# EAGLE design SSTuino_Evo (EAGLE 9.6.2)

## Sheet 1 of 2
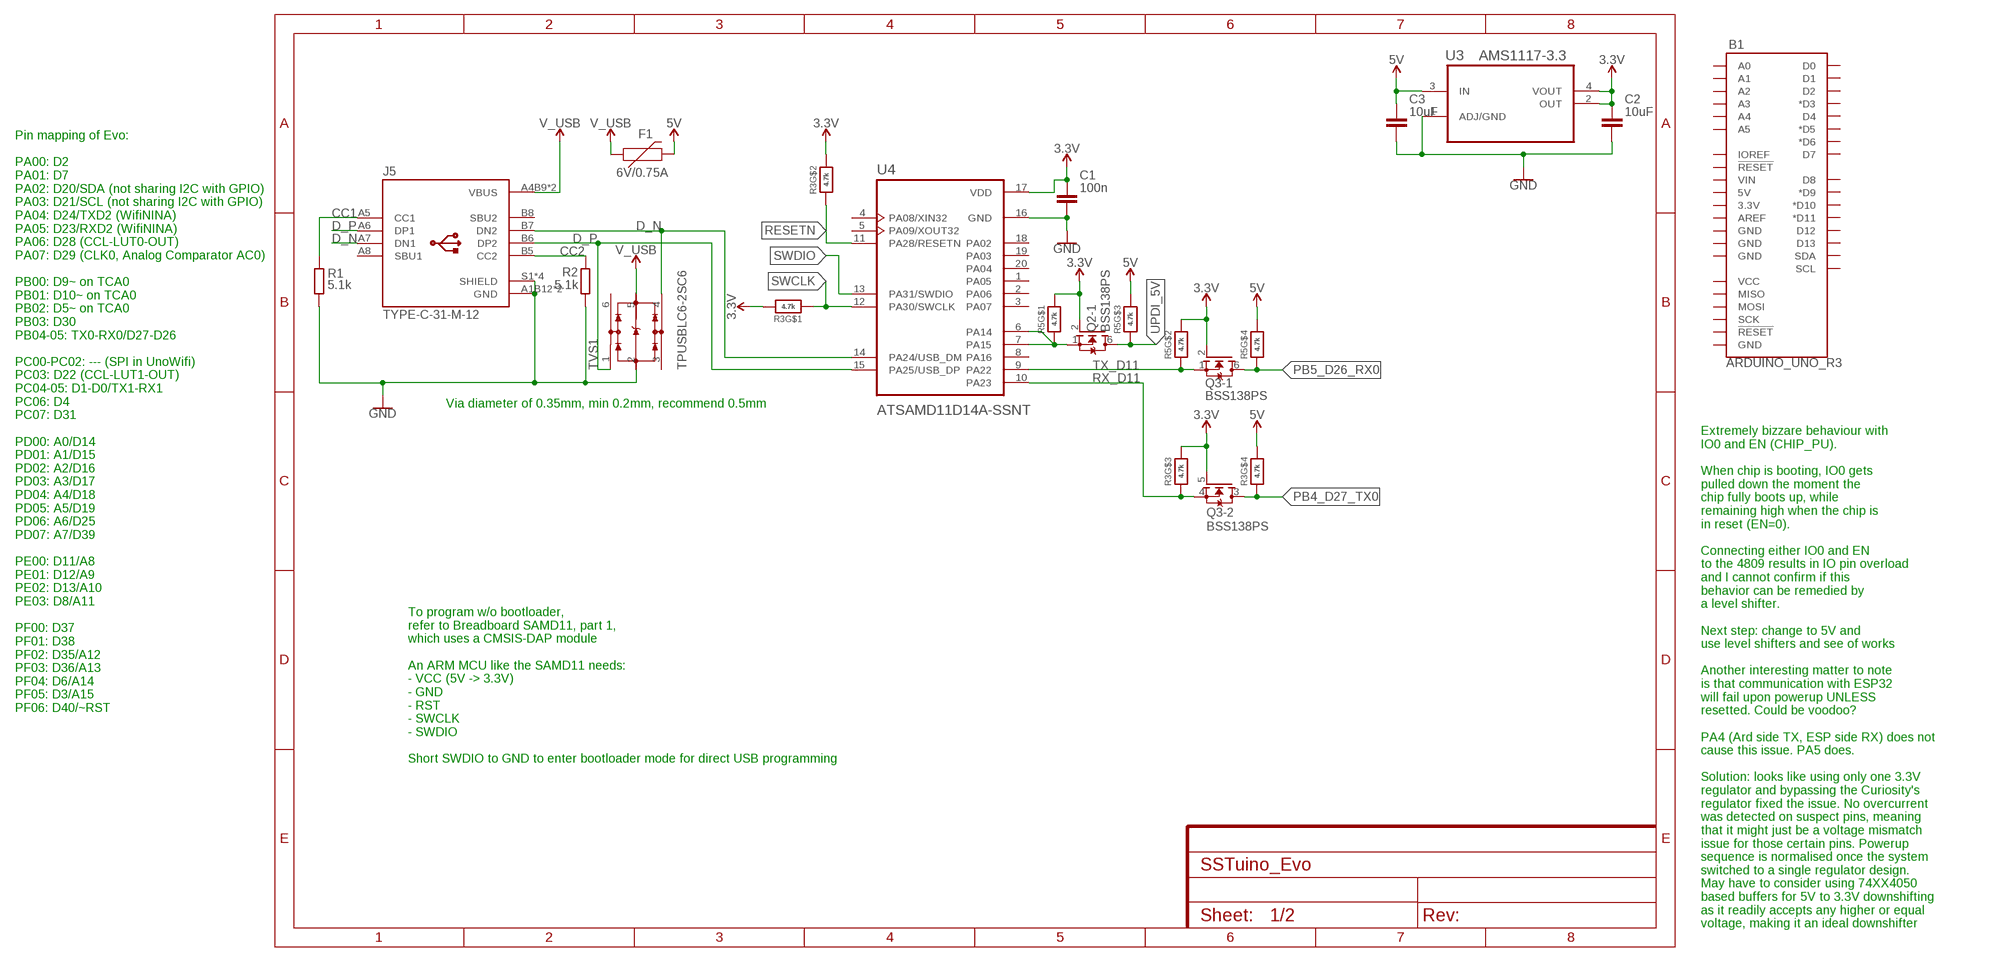
[diagram p0: schematic, sheet 1]

### Parts
B1  ARDUINO_UNO_R3  [ARDUINO_R3]
C1  100n  C_CHIP-0402(1005-METRIC)  [CAPC1005X60]
C2  10uF  C_CHIP-0603(1608-METRIC)  [CAPC1608X85]
C3  10uF  C_CHIP-0603(1608-METRIC)  [CAPC1608X85]
F1  6V/0.75A  PPTC_THREE-QUARTER-AMP  [1206]
J5  TYPE-C-31-M-12  [HRO_TYPE-C-31-M-12]
Q2  BSS138PS  [ARDUINO-TRANSISTORS_SOT363]
Q3  BSS138PS  [ARDUINO-TRANSISTORS_SOT363]
R1  5.1k  R_CHIP-0402(1005-METRIC)  [RESC1005X40]
R2  5.1k  R_CHIP-0402(1005-METRIC)  [RESC1005X40]
R3  4.7k  RESISTOR_4PACK0402  [RESPACK_4X0402]
R5  4.7k  RESISTOR_4PACK0402  [RESPACK_4X0402]
TVS1  TPUSBLC6-2SC6  [SOT95P280X110-6N]
U3  AMS1117-3.3  LM1117MP-3.3  [SOT230P696X180-4N]
U4  ATSAMD11D14A-SSNT  [SOIC127P1030X265-20N]

### Nets
3.3V: C1.1 C2.1 Q2.2(-1:G) Q3.2(-1:G) Q3.5(-2:G) R3.6 R3.7 R3.8 R5.7 R5.8 U3.2(OUT) U3.4(VOUT) U4.17(VDD) ; also sheet 2
5V: C3.1 F1.2 R3.5 R5.5 R5.6 U3.3(IN) ; also sheet 2
CC1: J5.A5(CC1) R1.1
CC2: J5.B5(CC2) R2.2
D_N [differential]: J5.A7(DN1) J5.B7(DN2) TVS1.4(IO3) U4.14(PA24/USB_DM)
D_P [differential]: J5.A6(DP1) J5.B6(DP2) TVS1.1(IO1) U4.15(PA25/USB_DP)
GND: C1.2 C2.2 C3.2 J5.A1B12(GND) J5.B1A12(GND) J5.S1(SHIELD) J5.S2(SHIELD) J5.S3(SHIELD) J5.S4(SHIELD) R1.2 R2.1 TVS1.2(VSS) U3.1(ADJ/GND) U4.16(GND) ; also sheet 2
PB4_D27_TX0: Q3.3(-2:D) R3.4 ; also sheet 2
PB5_D26_RX0: Q3.6(-1:D) R5.4 ; also sheet 2
RESETN: R3.2 U4.11(PA28/RESETN) ; also sheet 2
RX_D11: Q3.4(-2:S) R3.3 U4.10(PA23)
SWCLK: R3.1 U4.12(PA30/SWCLK) ; also sheet 2
SWDIO: U4.13(PA31/SWDIO) ; also sheet 2
TX_D11: Q3.1(-1:S) R5.2 U4.9(PA22)
UPDI_3V3: Q2.1(-1:S) R5.1 U4.6(PA14) U4.7(PA15)
UPDI_5V: Q2.6(-1:D) R5.3 ; also sheet 2
V_USB: F1.1 J5.A4B9(VBUS) J5.B4A9(VBUS) TVS1.5(VCC)
Unconnected: B1.3.3V B1.5V B1.A0 B1.A1 B1.A2 B1.A3 B1.A4 B1.A5 B1.AREF B1.D0 B1.D1 B1.D2 B1.D3(*D3) B1.D4 B1.D5(*D5) B1.D6(*D6) B1.D7 B1.D8 B1.D9(*D9) B1.D10(*D10) B1.D11(*D11) B1.D12 B1.D13 B1.GND@1(GND) B1.GND@2(GND) B1.GND@3(GND) B1.GND@4(GND) B1.IOREF B1.MISO B1.MOSI B1.RESET@1(!RESET!) B1.RESET@2(!RESET!) B1.SCK B1.SCL B1.SDA B1.VCC B1.VIN J5.A8(SBU1) J5.B8(SBU2) TVS1.3(IO2) TVS1.6(IO4) U4.1(PA05) U4.2(PA06) U4.3(PA07) U4.4(PA08/XIN32) U4.5(PA09/XOUT32) U4.8(PA16) U4.18(PA02) U4.19(PA03) U4.20(PA04)

### Notes on the sheet
- Via diameter of 0.35mm, min 0.2mm, recommend 0.5mm
- Pin mapping of Evo:
  
  PA00: D2
  PA01: D7
  PA02: D20/SDA (not sharing I2C with GPIO)
  PA03: D21/SCL (not sharing I2C with GPIO)
  PA04: D24/TXD2 (WifiNINA)
  PA05: D23/RXD2 (WifiNINA)
  PA06: D28 (CCL-LUT0-OUT)
  PA07: D29 (CLK0, Analog Comparator AC0)
  
  PB00: D9~ on TCA0
  PB01: D10~ on TCA0
  PB02: D5~ on TCA0
  PB03: D30
  PB04-05: TX0-RX0/D27-D26
  
  PC00-PC02: --- (SPI in UnoWifi)
  PC03: D22 (CCL-LUT1-OUT)
  PC04-05: D1-D0/TX1-RX1
  PC06: D4
  PC07: D31
  
  PD00: A0/D14
  PD01: A1/D15
  PD02: A2/D16
  PD03: A3/D17
  PD04: A4/D18
  PD05: A5/D19
  PD06: A6/D25
  PD07: A7/D39
  
  PE00: D11/A8
  PE01: D12/A9
  PE02: D13/A10
  PE03: D8/A11
  
  PF00: D37
  PF01: D38
  PF02: D35/A12
  PF03: D36/A13
  PF04: D6/A14
  PF05: D3/A15
  PF06: D40/~RST
- To program w/o bootloader,
  refer to Breadboard SAMD11, part 1,
  which uses a CMSIS-DAP module
  
  An ARM MCU like the SAMD11 needs:
  - VCC (5V -> 3.3V)
  - GND
  - RST
  - SWCLK
  - SWDIO
  
  Short SWDIO to GND to enter bootloader mode for direct USB programming
- Extremely bizzare behaviour with
  IO0 and EN (CHIP_PU). 
  
  When chip is booting, IO0 gets 
  pulled down the moment the 
  chip fully boots up, while 
  remaining high when the chip is
  in reset (EN=0).
  
  Connecting either IO0 and EN
  to the 4809 results in IO pin overload
  and I cannot confirm if this
  behavior can be remedied by
  a level shifter. 
  
  Next step: change to 5V and
  use level shifters and see of works
  
  Another interesting matter to note
  is that communication with ESP32
  will fail upon powerup UNLESS
  resetted. Could be voodoo?
  
  PA4 (Ard side TX, ESP side RX) does not
  cause this issue. PA5 does.
  
  Solution: looks like using only one 3.3V 
  regulator and bypassing the Curiosity's
  regulator fixed the issue. No overcurrent
  was detected on suspect pins, meaning
  that it might just be a voltage mismatch
  issue for those certain pins. Powerup
  sequence is normalised once the system
  switched to a single regulator design.
  May have to consider using 74XX4050
  based buffers for 5V to 3.3V downshifting
  as it readily accepts any higher or equal
  voltage, making it an ideal downshifter

## Sheet 2 of 2
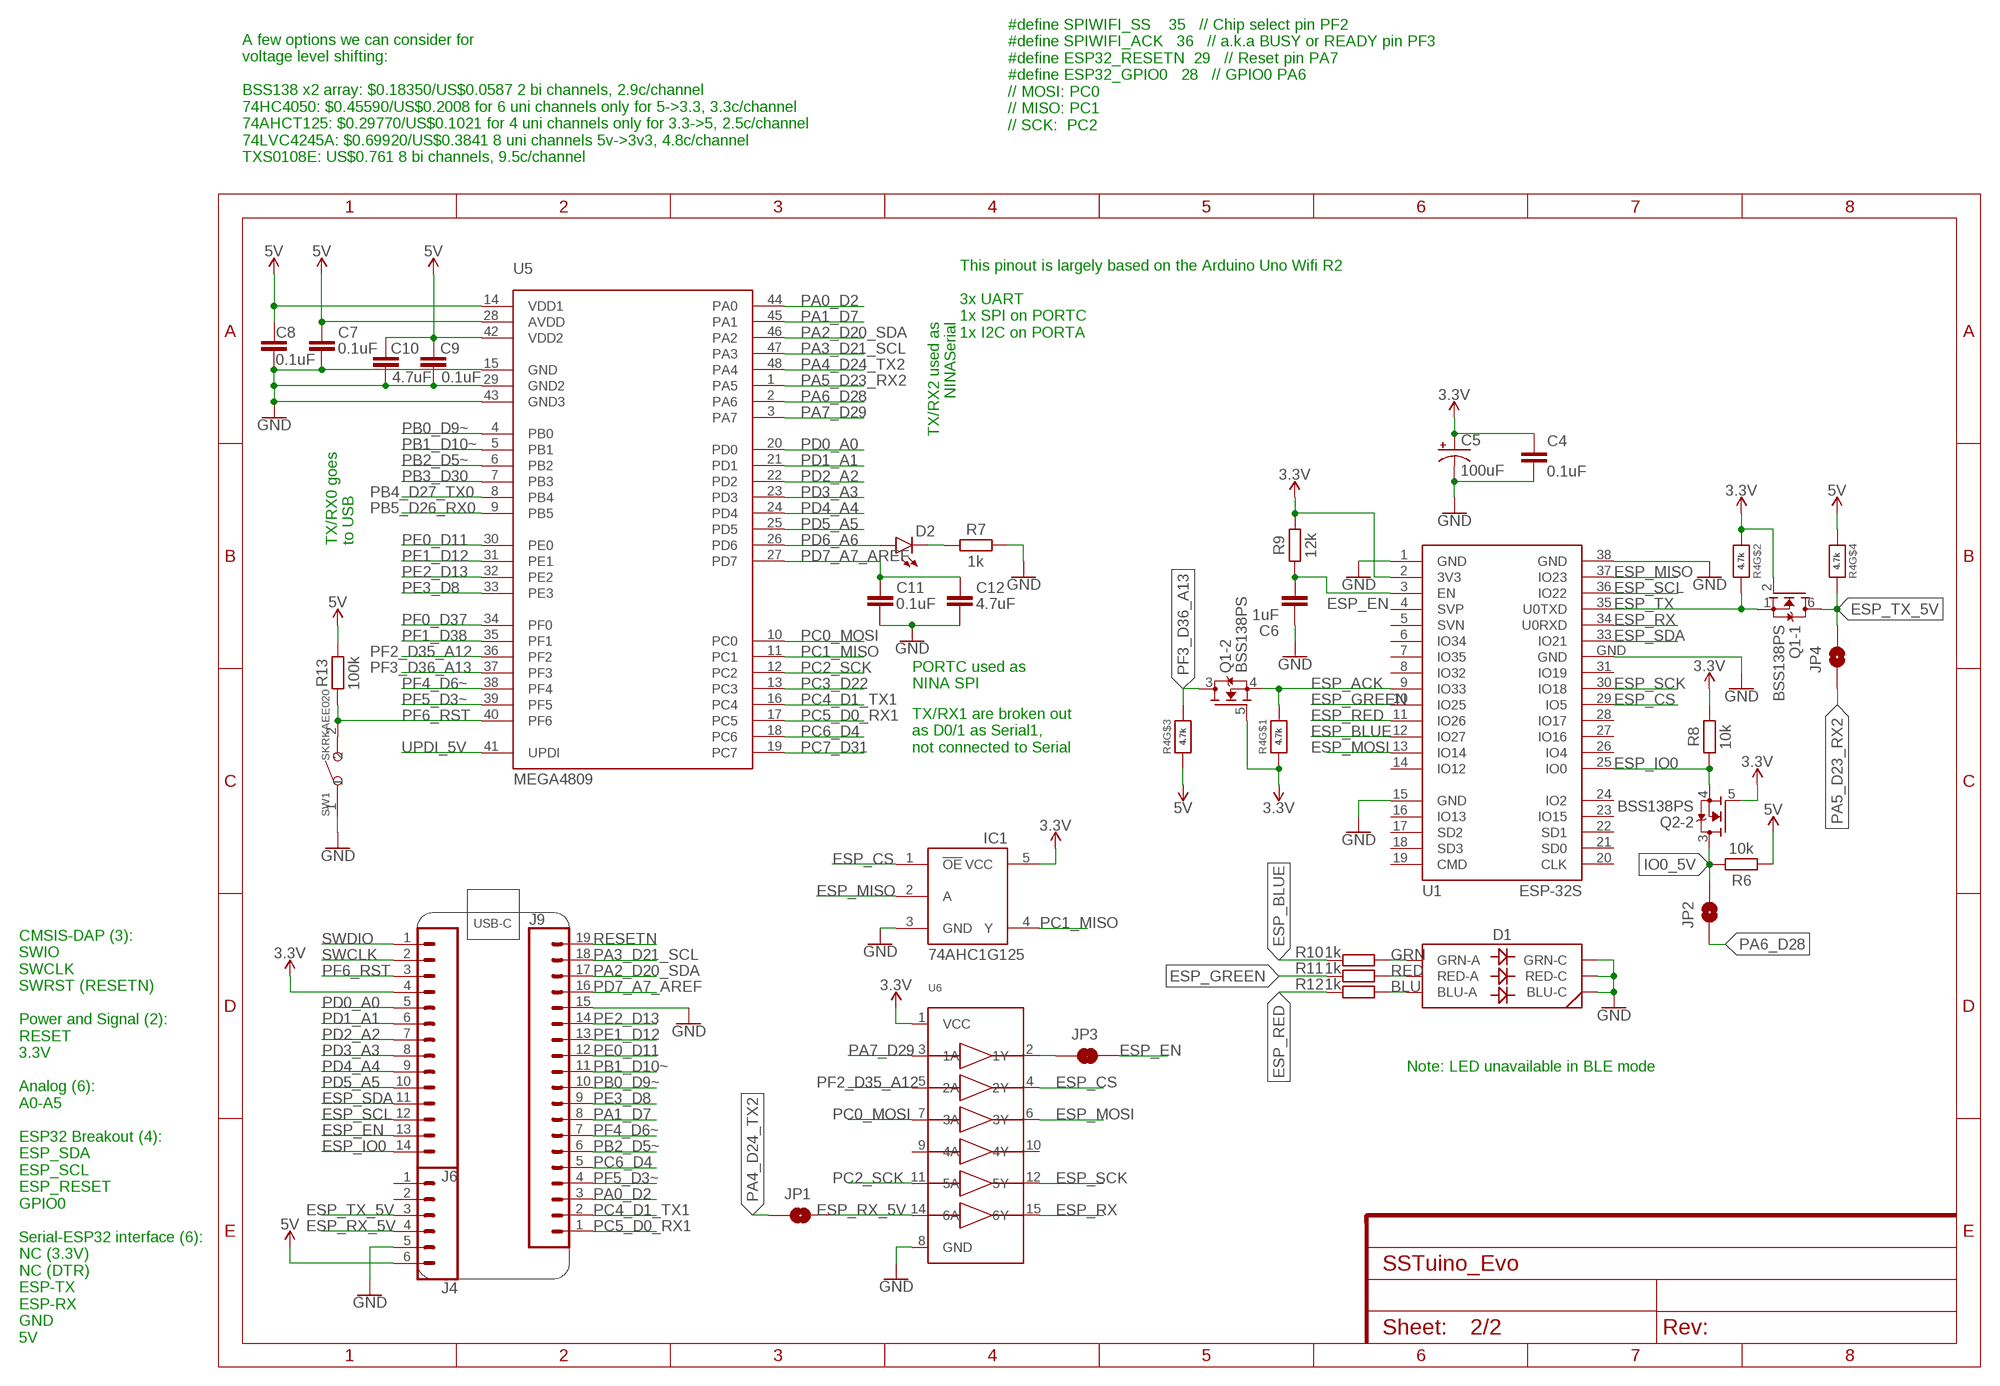
[diagram p1: schematic, sheet 2]

### Parts
C4  0.1uF  C_CHIP-0402(1005-METRIC)  [CAPC1005X60]
C5  100uF  C-POL-US_TANTALUM-1206(3216-METRIC)  [CAPMP3216X180N]
C6  1uF  C_CHIP-0402(1005-METRIC)  [CAPC1005X60]
C7  0.1uF  C_CHIP-0402(1005-METRIC)  [CAPC1005X60]
C8  0.1uF  C_CHIP-0402(1005-METRIC)  [CAPC1005X60]
C9  0.1uF  C_CHIP-0402(1005-METRIC)  [CAPC1005X60]
C10  4.7uF  C_CHIP-0402(1005-METRIC)  [CAPC1005X60]
C11  0.1uF  C_CHIP-0402(1005-METRIC)  [CAPC1005X60]
C12  4.7uF  C_CHIP-0402(1005-METRIC)  [CAPC1005X60]
D1  LED-RGBTC5050RGBF08  [LED-TRICOLOR-5050]
D2  LED0603  [LED-0603]
IC1  74AHC1G125  [SOT23-5L]
J4  CONN_06NO_SILK_FEMALE_PTH  [1X06_NO_SILK]
J6  CONN_14NO_SILK  [1X14_NO_SILK]
J9  CONN_191X19_NO_SILK  [1X19_NO_SILK]
JP1  JUMPER-SMT_2_NO_SILK  [SMT-JUMPER_2_NO_SILK]
JP2  JUMPER-SMT_2_NO_SILK  [SMT-JUMPER_2_NO_SILK]
JP3  JUMPER-SMT_2_NC_TRACE_SILK  [SMT-JUMPER_2_NC_TRACE_SILK]
JP4  JUMPER-SMT_2_NO_SILK  [SMT-JUMPER_2_NO_SILK]
Q1  BSS138PS  [ARDUINO-TRANSISTORS_SOT363]
R4  4.7k  RESISTOR_4PACK0402  [RESPACK_4X0402]
R6  10k  R_CHIP-0402(1005-METRIC)  [RESC1005X40]
R7  1k  R_CHIP-0402(1005-METRIC)  [RESC1005X40]
R8  10k  R_CHIP-0402(1005-METRIC)  [RESC1005X40]
R9  12k  R_CHIP-0402(1005-METRIC)  [RESC1005X40]
R10  1k  R_CHIP-0402(1005-METRIC)  [RESC1005X40]
R11  1k  R_CHIP-0402(1005-METRIC)  [RESC1005X40]
R12  1k  R_CHIP-0402(1005-METRIC)  [RESC1005X40]
R13  100k  R_CHIP-0402(1005-METRIC)  [RESC1005X40]
SW1  SKRKAEE020  SMD-BUTTON(2P-3.9X2.9X1.5+0.4MM)-SKRKAEE020  [SW2-2.6-3.9X2.9X1.5+0.4MM]
U1  ESP-32S  [ESP-32S]
U5  MEGA4809  [TQFP48]
U6  74HC4050DTSSOP  [TSSOP16]

### Nets
3.3V: C4.1 C5.1(+) IC1.5(VCC) J6.4 Q1.2(-1:G) Q1.5(-2:G) Q2.5(-2:G) R4.1 R4.2 R8.2 R9.2 U1.2(3V3) U6.1(VCC) ; also sheet 1
5V: C7.1 C8.1 C9.1 C10.1 J4.6 R4.3 R4.4 R6.1 R13.2 U5.14(VDD1) U5.28(AVDD) U5.42(VDD2) ; also sheet 1
BLU: D1.6(BLU-A) R12.2
ESP_ACK: Q1.4(-2:S) R4.8 U1.9(IO33)
ESP_BLUE: R10.1 U1.12(IO27)
ESP_CS: IC1.1(!OE) U1.29(IO5) U6.4(2Y)
ESP_EN: C6.2 J6.13 JP3.2 R9.1 U1.3(EN)
ESP_GREEN: R11.1 U1.10(IO25)
ESP_IO0: J6.14 Q2.4(-2:S) R8.1 U1.25(IO0)
ESP_MISO: IC1.2(A) U1.37(IO23)
ESP_MOSI: U1.13(IO14) U6.6(3Y)
ESP_RED: R12.1 U1.11(IO26)
ESP_RX: U1.34(U0RXD) U6.15(6Y)
ESP_RX_5V: J4.4 JP1.2 U6.14(6A)
ESP_SCK: U1.30(IO18) U6.12(5Y)
ESP_SCL: J6.12 U1.36(IO22)
ESP_SDA: J6.11 U1.33(IO21)
ESP_TX: Q1.1(-1:S) R4.7 U1.35(U0TXD)
ESP_TX_5V: J4.3 JP4.2 Q1.6(-1:D) R4.5
GND: C4.2 C5.2(-) C6.1 C7.2 C8.2 C9.2 C10.2 C11.2 C12.2 D1.1(BLU-C) D1.2(RED-C) D1.3(GRN-C) IC1.3(GND) J4.5 J9.15 R7.2 SW1.1 U1.1(GND) U1.15(GND) U1.38(GND) U1.GND U5.15(GND) U5.29(GND2) U5.43(GND3) U6.8(GND) ; also sheet 1
GRN: D1.4(GRN-A) R10.2
IO0_5V: JP2.2 Q2.3(-2:D) R6.2
N$2: D2.C R7.1
N$4: JP3.1 U6.2(1Y)
PA0_D2: J9.3 U5.44(PA0)
PA1_D7: J9.8 U5.45(PA1)
PA2_D20_SDA: J9.17 U5.46(PA2)
PA3_D21_SCL: J9.18 U5.47(PA3)
PA4_D24_TX2: JP1.1 U5.48(PA4)
PA5_D23_RX2: JP4.1 U5.1(PA5)
PA6_D28: JP2.1 U5.2(PA6)
PA7_D29: U5.3(PA7) U6.3(1A)
PB0_D9~: J9.10 U5.4(PB0)
PB1_D10~: J9.11 U5.5(PB1)
PB2_D5~: J9.6 U5.6(PB2)
PB3_D30: U5.7(PB3)
PB4_D27_TX0: U5.8(PB4) ; also sheet 1
PB5_D26_RX0: U5.9(PB5) ; also sheet 1
PC0_MOSI: U5.10(PC0) U6.7(3A)
PC1_MISO: IC1.4(Y) U5.11(PC1)
PC2_SCK: U5.12(PC2) U6.11(5A)
PC3_D22: U5.13(PC3)
PC4_D1_TX1: J9.2 U5.16(PC4)
PC5_D0_RX1: J9.1 U5.17(PC5)
PC6_D4: J9.5 U5.18(PC6)
PC7_D31: U5.19(PC7)
PD0_A0: J6.5 U5.20(PD0)
PD1_A1: J6.6 U5.21(PD1)
PD2_A2: J6.7 U5.22(PD2)
PD3_A3: J6.8 U5.23(PD3)
PD4_A4: J6.9 U5.24(PD4)
PD5_A5: J6.10 U5.25(PD5)
PD6_A6: D2.A U5.26(PD6)
PD7_A7_AREF: C11.1 C12.1 J9.16 U5.27(PD7)
PE0_D11: J9.12 U5.30(PE0)
PE1_D12: J9.13 U5.31(PE1)
PE2_D13: J9.14 U5.32(PE2)
PE3_D8: J9.9 U5.33(PE3)
PF0_D37: U5.34(PF0)
PF1_D38: U5.35(PF1)
PF2_D35_A12: U5.36(PF2) U6.5(2A)
PF3_D36_A13: Q1.3(-2:D) R4.6 U5.37(PF3)
PF4_D6~: J9.7 U5.38(PF4)
PF5_D3~: J9.4 U5.39(PF5)
PF6_RST: J6.3 R13.1 SW1.2 U5.40(PF6)
RED: D1.5(RED-A) R11.2
RESETN: J9.19 ; also sheet 1
SWCLK: J6.2 ; also sheet 1
SWDIO: J6.1 ; also sheet 1
UPDI_5V: U5.41(UPDI) ; also sheet 1
Unconnected: J4.1 J4.2 U1.4(SVP) U1.5(SVN) U1.6(IO34) U1.7(IO35) U1.8(IO32) U1.14(IO12) U1.16(IO13) U1.17(SD2) U1.18(SD3) U1.19(CMD) U1.20(CLK) U1.21(SD0) U1.22(SD1) U1.23(IO15) U1.24(IO2) U1.26(IO4) U1.27(IO16) U1.28(IO17) U1.31(IO19) U6.9(4A) U6.10(4Y)

### Notes on the sheet
- #define SPIWIFI_SS    35   // Chip select pin PF2
  #define SPIWIFI_ACK   36   // a.k.a BUSY or READY pin PF3
  #define ESP32_RESETN  29   // Reset pin PA7
  #define ESP32_GPIO0   28   // GPIO0 PA6
  // MOSI: PC0
  // MISO: PC1
  // SCK:  PC2
- A few options we can consider for
  voltage level shifting:
  
  BSS138 x2 array: $0.18350/US$0.0587 2 bi channels, 2.9c/channel
  74HC4050: $0.45590/US$0.2008 for 6 uni channels only for 5->3.3, 3.3c/channel
  74AHCT125: $0.29770/US$0.1021 for 4 uni channels only for 3.3->5, 2.5c/channel
  74LVC4245A: $0.69920/US$0.3841 8 uni channels 5v->3v3, 4.8c/channel
  TXS0108E: US$0.761 8 bi channels, 9.5c/channel
- TX/RX2 used as
  NINASerial
- This pinout is largely based on the Arduino Uno Wifi R2
  
  3x UART
  1x SPI on PORTC
  1x I2C on PORTA
- TX/RX0 goes
  to USB
- PORTC used as
  NINA SPI
- TX/RX1 are broken out 
  as D0/1 as Serial1,
  not connected to Serial
- USB-C
- Note: LED unavailable in BLE mode
- CMSIS-DAP (3):
  SWIO
  SWCLK
  SWRST (RESETN)
  
  Power and Signal (2):
  RESET
  3.3V
  
  Analog (6):
  A0-A5
  
  ESP32 Breakout (4):
  ESP_SDA
  ESP_SCL
  ESP_RESET
  GPIO0
  
  Serial-ESP32 interface (6):
  NC (3.3V)
  NC (DTR)
  ESP-TX
  ESP-RX
  GND
  5V

## Library data of the parts
B1 = SparkFun-Boards:ARDUINO_UNO_R3: Arduino R3 Footprint with SPI header Arduino Uno R3 Compatible Footprint. Matches PCB size of the original board. SparkFun Products: SAMD21 Dev Breakout <https://www.sparkfun.com/products/13672> RedBoard <https://www.sparkfun.com/products/12757> R3 Stackable Headers <https://www.sparkfun.com/products/11417>
C1-C4 C6-C12 = Capacitor:C: Capacitor - Generic; CATEGORY: Capacitor
C5 = Capacitor:C-POL-US: Capacitor Polarised - ANSI; CATEGORY: Capacitor
D1 = D3ltav's Custom:LED-RGB: LED-RGB 6 pin RGB LED (no common connector) Warning: please check and double check your pinout vs. the datasheet! 5050 SMD LEDs are commonly packaged in all sorts of weird, non-standard pinouts. This footprint and symbol is only applicable to the LED mentioned below Packages: LED-TRICOLOR-5050 - Based on TC5050RGBF08 RGB LED <https://datasheet.lcsc.com/szlcsc/2009231707_TCWIN-TC5050RGBF08-3CJH-AF53A_C784540.pdf>; PROD_ID: DIO-10298
D2 = SparkFun-LED:LED: LED (Generic) Standard schematic elements and footprints for 5mm, 3mm, 1206, and 0603 sized LEDs. Generic LEDs with no color specified.
F1 = SparkFun-Fuses:PPTC: Resettable Fuse PPTC Resettable Fuse. Really a sort of resistor with a polymeric positive temperature coefficient whose resistance increases dramatically with an increase in temperature. When heated by the power passing through the resistance rises causing the current to be limited, protecting the circuit. This is achieved by the transition of the polymer from a crystalline to an amorphous state where the conductive carbon separates breaking the conductive pathways found in the cool crystalline structure. When a PPTC cools back down it resumes conducting letting the circuit turn back on. SparkFun Products: SparkFun RedBoard - Programmed with Arduino <https://www.sparkfun.com/products/12757> Pro Micro - 5V/16MHz <https://www.sparkfun.com/products/12640> Arduino Pro 328 - 5V/16MHz <https://www.sparkfun.com/products/10915> MP3 Trigger <https://www.sparkfun.com/products/13720>; LCSC_PART: C99563; PROD_ID: RES-11150
IC1 = adafruit:74AHC1G125; LCSC_PART: C124295
J4 = SparkFun-Connectors:CONN_06: Multi connection point. Often used as Generic Header-pin footprint for 0.1 inch spaced/style header connections On any of the 0.1 inch spaced packages, you can populate with these: Break Away Headers - Straight <https://www.sparkfun.com/products/116> (PRT-00116) Break Away Male Headers - Right Angle <https://www.sparkfun.com/products/553> (PRT-00553) Female Headers <https://www.sparkfun.com/products/115> (PRT-00115) Break Away Headers - Machine Pin <https://www.sparkfun.com/products/117> (PRT-00117) Break Away Female Headers - Swiss Machine Pin <https://www.sparkfun.com/products/743> (PRT-00743) Arduino Stackable Header - 6 Pin <https://www.sparkfun.com/products/9280> (PRT-09280) For SCREWTERMINALS and SPRING TERMINALS visit here: Screw Terimnals on SparkFun.com <https://www.sparkfun.com/search/results?term=Screw+Terminals> (5mm/3.5mm/2.54mm spacing) This device is also useful as a general connection point to wire up your design to another part of your project. Our various solder wires solder well into these plated through hole pads. Hook-Up Wire - Assortment (Stranded, 22 AWG) <https://www.sparkfun.com/products/11375> (PRT-11375) Hook-Up Wire - Assortment (Solid Core, 22 AWG) <https://www.sparkfun.com/products/11367> (PRT-11367) View the entire wire category on our website here <https://www.sparkfun.com/categories/141>; PROD_ID: CONN-08437
J5 = D3ltav's Custom:TYPE-C-31-M-12: USB Connectors 24 Receptacle 1 8.94*7.3mm RoHS Check prices <https://pricing.snapeda.com/parts/TYPE-C-31-M-12/HRO%20Electronics%20Co.%2C%20Ltd./view-part?ref=eda>; AVAILABILITY: No availability data; DESCRIPTION: USB Connectors 24 Receptacle 1 8.94*7.3mm RoHS; LCSC_PART: C165948; MF: HRO Electronics Co., Ltd.; MP: TYPE-C-31-M-12; PACKAGE: Package; PRICE: None
J6 = SparkFun-Connectors:CONN_14: Multi connection point. Often used as Generic Header-pin footprint for 0.1 inch spaced/style header connections On any of the 0.1 inch spaced packages, you can populate with these: Break Away Headers - Straight <https://www.sparkfun.com/products/116> (PRT-00116) Break Away Male Headers - Right Angle <https://www.sparkfun.com/products/553> (PRT-00553) Female Headers <https://www.sparkfun.com/products/115> (PRT-00115) Break Away Headers - Machine Pin <https://www.sparkfun.com/products/117> (PRT-00117) Break Away Female Headers - Swiss Machine Pin <https://www.sparkfun.com/products/743> (PRT-00743) For SCREWTERMINALS and SPRING TERMINALS visit here: Screw Terimnals on SparkFun.com <https://www.sparkfun.com/search/results?term=Screw+Terminals> (5mm/3.5mm/2.54mm spacing) This device is also useful as a general connection point to wire up your design to another part of your project. Our various solder wires solder well into these plated through hole pads. Hook-Up Wire - Assortment (Stranded, 22 AWG) <https://www.sparkfun.com/products/11375> (PRT-11375) Hook-Up Wire - Assortment (Solid Core, 22 AWG) <https://www.sparkfun.com/products/11367> (PRT-11367) View the entire wire category on our website here <https://www.sparkfun.com/categories/141> Special notes: Molex polarized connector foot print use with SKU : PRT-08231 with associated crimp pins and housings. 1MM SMD Version SKU: PRT-10208 NOTES ON THE VARIANTS LOCK and LOCK_LONGPADS... This footprint was designed to help hold the alignment of a through-hole component (i.e. 6-pin header) while soldering it into place. You may notice that each hole has been shifted either up or down by 0.005 of an inch from it's more standard position (which is a perfectly straight line). This slight alteration caused the pins (the squares in the middle) to touch the edges of the holes. Because they are alternating, it causes a "brace" to hold the component in place. 0.005 has proven to be the perfect amount of "off-center" position when using our standard breakaway headers. Although looks a little odd when you look at the bare footprint, once you have a header in there, the alteration is very hard to notice. Also,if you push a header all the way into place, it is covered up entirely on the bottom side.
J9 = SparkFun-Connectors:CONN_19: Multi connection point. Often used as Generic Header-pin footprint for 0.1 inch spaced/style header connections On any of the 0.1 inch spaced packages, you can populate with these: Break Away Headers - Straight <https://www.sparkfun.com/products/116> (PRT-00116) Break Away Male Headers - Right Angle <https://www.sparkfun.com/products/553> (PRT-00553) Female Headers <https://www.sparkfun.com/products/115> (PRT-00115) Break Away Headers - Machine Pin <https://www.sparkfun.com/products/117> (PRT-00117) Break Away Female Headers - Swiss Machine Pin <https://www.sparkfun.com/products/743> (PRT-00743) For SCREWTERMINALS and SPRING TERMINALS visit here: Screw Terimnals on SparkFun.com <https://www.sparkfun.com/search/results?term=Screw+Terminals> (5mm/3.5mm/2.54mm spacing) This device is also useful as a general connection point to wire up your design to another part of your project. Our various solder wires solder well into these plated through hole pads. Hook-Up Wire - Assortment (Stranded, 22 AWG) <https://www.sparkfun.com/products/11375> (PRT-11375) Hook-Up Wire - Assortment (Solid Core, 22 AWG) <https://www.sparkfun.com/products/11367> (PRT-11367) View the entire wire category on our website here <https://www.sparkfun.com/categories/141> Special notes: Molex polarized connector foot print use with SKU : PRT-08231 with associated crimp pins and housings. 1MM SMD Version SKU: PRT-10208 NOTES ON THE VARIANTS LOCK and LOCK_LONGPADS... This footprint was designed to help hold the alignment of a through-hole component (i.e. 6-pin header) while soldering it into place. You may notice that each hole has been shifted either up or down by 0.005 of an inch from it's more standard position (which is a perfectly straight line). This slight alteration caused the pins (the squares in the middle) to touch the edges of the holes. Because they are alternating, it causes a "brace" to hold the component in place. 0.005 has proven to be the perfect amount of "off-center" position when using our standard breakaway headers. Although looks a little odd when you look at the bare footprint, once you have a header in there, the alteration is very hard to notice. Also,if you push a header all the way into place, it is covered up entirely on the bottom side.
JP1 JP2 JP4 = SparkFun-Jumpers:JUMPER-SMT_2_NO: Normally open jumper This jumper has two pads in close proximity to each other. Apply solder to close the connection. Round pads are easier to solder for beginners, but are a lot larger. SparkFun Product that uses the round pads: SparkFun EL Sequencer <https://www.sparkfun.com/products/12781>
JP3 = SparkFun-Jumpers:JUMPER-SMT_2_NC_TRACE: Normally closed trace jumper This jumper has a trace between two pads so it's normally closed (NC). Use a razor knife to open the connection. For best results follow the IPC guidelines for cutting traces: Cutout at least 0.063 mm (0.005 in). Remove all loose material to clean up the cut area. Seal the cut with an approved epoxy. Reapply solder to reclose the connection.
Q1-Q3 = D3ltav's Custom:BSS138PS: MOSFET 2N-CH 60V 0.32A 6TSSOP; CODE-ARDUINO: 2323; DATASHEET: https://assets.nexperia.com/documents/data-sheet/BSS138PS.pdf; DISTRIBUTOR-LINK: http://www.digikey.com/product-detail/en/nxp-semiconductors/BSS138PS,115/568-8393-1-ND/2763927; DISTRIBUTOR-PN: 568-8393-1-ND; LCSC_PART: C193381; MANUFACTURER: NXP; MANUFACTURER-PN: BSS138PS,115
R1 R2 R6-R13 = Resistor:R: Resistor Fixed - Generic; CATEGORY: Resistor; SUB-CATEGORY: Fixed
R3-R5 = D3ltav's Custom:RESISTOR_4PACK: Resistor Packs (4 resistors) 4 x 0603 10K 1/16W - Digikey: YC164J-10KCT-ND; LCSC_PART: C1980
SW1 = D3ltav's Custom:SMD-BUTTON(2P-3.9X2.9X1.5+0.4MM): 311020047; LCSC_PART: C115357; MPN: SKRKAEE020
TVS1 = D3ltav's Custom:TPUSBLC6-2SC6: TPUSBLC6-2SC6 Low Capacitance 2-Line ESD Protection www.sot23.com.tw; LCSC_PART: C558442
U1 = esp32:ESP-32S: Ai-Thinker ESP-32S
U3 = D3ltav's Custom:LM1117MP-3.3: Linear regulators; LCSC_PART: C6186; MPN: LM1117MP-3.3; OC_FARNELL: 9778195; OC_NEWARK: 41K3470; PACKAGE: SOT223-3; SUPPLIER: NationalSemiconductor
U4 = D3ltav's Custom:ATSAMD11D14A-SSNT; AVAILABILITY: In Stock; DESCRIPTION: ARM® Cortex®-M0+ SAM D11D Microcontroller IC 32-Bit 48MHz 16KB (16K x 8) FLASH 20-SOIC; LCSC_PART: C2053599; MF: Microchip; MP: ATSAMD11D14A-SSNT; PACKAGE: SOIC-20 Microchip; PRICE: None
U5 = microwavemont_ATMEGA4809:MEGA4809; LCSC_PART: C189475
U6 = D3ltav's Custom:74HC4050D: 6-channel level shifter 74HC4050D - 2V-6V Supply SOIC16 Digikey: 74HC4050D,653-ND Mouser: 771-74HC4050D-T TSSOP16 Digikey: 296-9215-1-ND Mouser:; LCSC_PART: C43181

## Net classes
0 default: width 0.254 mm, drill 0.35 mm
1 differential: width 0.254 mm

## Board
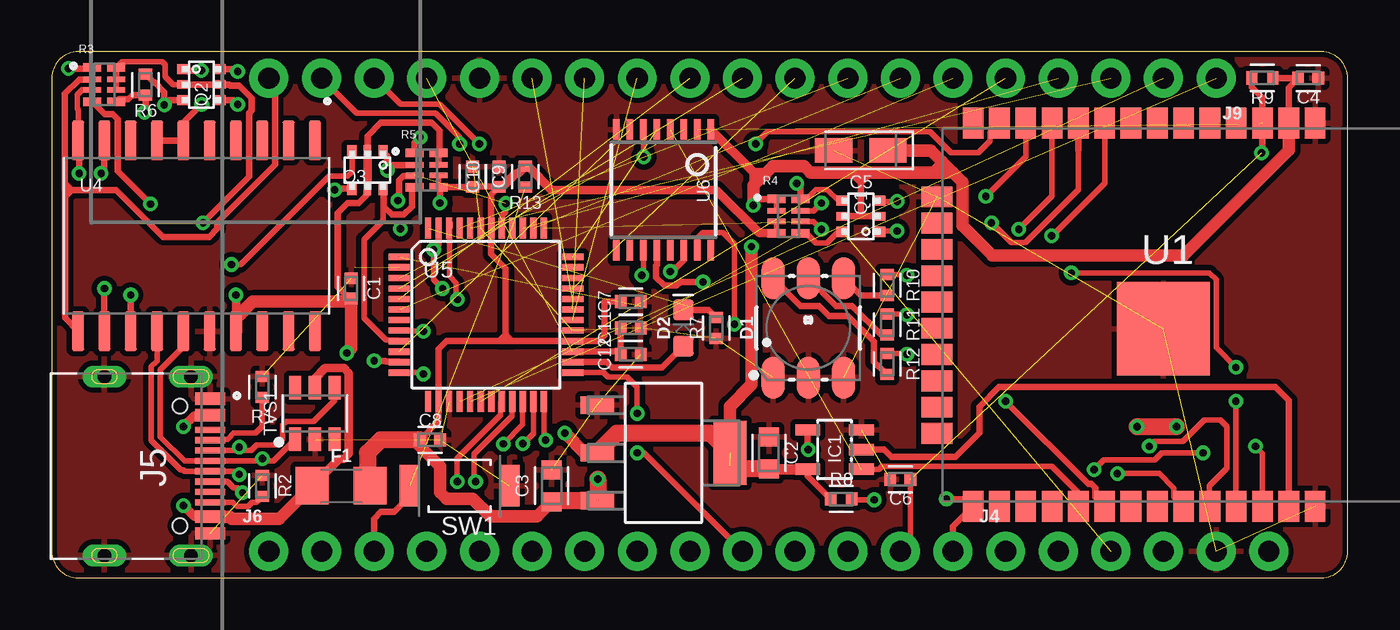
[diagram p2: board, top side]
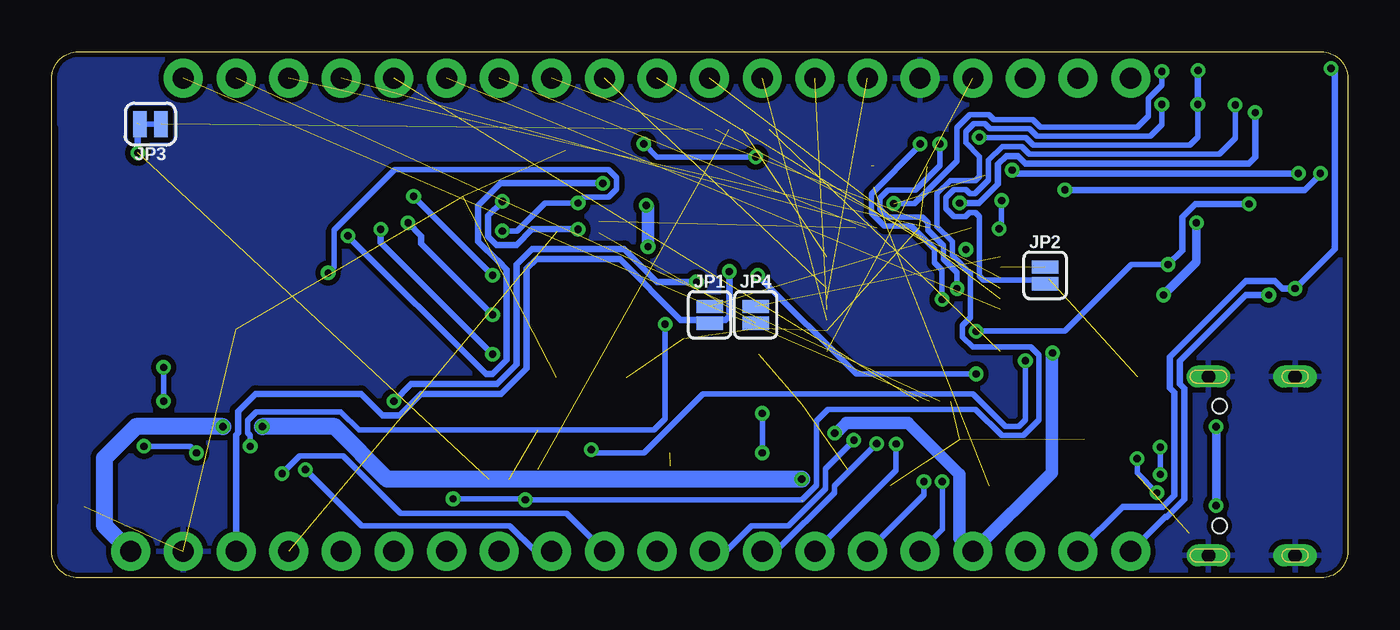
[diagram p3: board, bottom side, seen from below]

Size 62.55 x 25.4 mm. Coordinates in mm from the lower left corner, seen from the top.
Outline: 0,24.13 0,1.27 arc90 1.27,0 61.28,0 arc90 62.55,1.27 62.55,24.13 arc90 61.28,25.4 1.27,25.4 arc90 0,24.13
Copper layers (1*16): Top 0.035mm / dielectric 1.5mm / Bottom 0.035mm
Design rules "SparkFun-2-Layer-General-JLCPCB": minimum track width 7mil, minimum drill 0.3mm, track to track 7mil, track to pad 7mil, pad to pad 7mil, via to via 7mil, smd to smd 7mil, copper to edge 7mil, drill to drill 7mil, minimum pad ring 7mil, minimum via ring 7mil, stop-mask expansion 3mil, vias tented up to drill 25mil, thermal gap 10mil

### Footprints (pad centres in the part's own frame; a part is rotated, then mirrored left to right if it is on the bottom)
ARDUINO_R3 = drill 1.016 pad 1.93: 3.3V 2.54,-24.13; 5V 5.08,-24.13; A0 17.78,-24.13; A1 20.32,-24.13; A2 22.86,-24.13; A3 25.4,-24.13; A4 27.94,-24.13; A5 30.48,-24.13; AREF -9.144,24.13; D0 30.48,24.13; D1 27.94,24.13; D2 25.4,24.13; D3 22.86,24.13; D4 20.32,24.13; D5 17.78,24.13; D6 15.24,24.13; D7 12.7,24.13; D8 8.636,24.13; D9 6.096,24.13; D10 3.556,24.13; D11 1.016,24.13; D12 -1.524,24.13; D13 -4.064,24.13; GND@1 7.62,-24.13; GND@2 10.16,-24.13; GND@3 -6.604,24.13; GND@4 33.16,-1.32; IOREF -2.54,-24.13; MISO 30.62,3.76; MOSI 33.16,1.22; NC -5.08,-24.13; RESET@1 0,-24.13; RESET@2 30.62,-1.32; SCK 30.62,1.22; SCL -14.224,24.13; SDA -11.684,24.13; VCC 33.16,3.76; VIN 12.7,-24.13 | hole 3.175: -17.78,24.13; 33.02,8.89; 33.02,-19.05; -19.05,-24.13
CAPC1005X60 = smd 0.56 x 0.629: 1 -0.485,0; 2 0.485,0
CAPC1608X85 = smd 0.921 x 0.97: 1 -0.775,0; 2 0.775,0
CAPMP3216X180N = smd 1.796 x 1.189: 1 -1.31,0; 2 1.31,0
LED-TRICOLOR-5050 = smd 2 x 1.1: 1 2.4,-1.7; 2 2.4,0; 3 2.4,1.7; 4 -2.4,1.7; 5 -2.4,0; 6 -2.4,-1.7
LED-0603 = smd 1 x 1: A -0.877,0; C 0.877,0
1206 = smd 1.6 x 1.8: 1 -1.4,0; 2 1.4,0
SOT23-5L = smd 0.55 x 1.2: 1 -0.95,-1.3; 2 0,-1.3; 3 0.95,-1.3; 4 0.95,1.3; 5 -0.95,1.3
1X06_NO_SILK = drill 1.016 pad 1.88: 1 0,0; 2 2.54,0; 3 5.08,0; 4 7.62,0; 5 10.16,0; 6 12.7,0
HRO_TYPE-C-31-M-12 = smd 0.6 x 1.45: A1B12 -3.25,5.095; A4B9 -2.45,5.095; B1A12 3.25,5.095; B4A9 2.45,5.095 | smd 0.3 x 1.45: A5 -1.25,5.095; A6 -0.25,5.095; A7 0.25,5.095; A8 1.25,5.095; B5 1.75,5.095; B6 0.75,5.095; B7 -0.75,5.095; B8 -1.75,5.095 | drill 0.65 pad 1.05 long: S1 -4.32,4.18; S2 4.32,4.18; S3 -4.32,0; S4 4.32,0 | hole 0.7: -2.89,3.65; 2.89,3.65
1X14_NO_SILK = drill 1.016 pad 1.88: 1 0,0; 2 2.54,0; 3 5.08,0; 4 7.62,0; 5 10.16,0; 6 12.7,0; 7 15.24,0; 8 17.78,0; 9 20.32,0; 10 22.86,0; 11 25.4,0; 12 27.94,0; 13 30.48,0; 14 33.02,0
1X19_NO_SILK = drill 1.016 pad 1.88: 1 0,0; 2 2.54,0; 3 5.08,0; 4 7.62,0; 5 10.16,0; 6 12.7,0; 7 15.24,0; 8 17.78,0; 9 20.32,0; 10 22.86,0; 11 25.4,0; 12 27.94,0; 13 30.48,0; 14 33.02,0; 15 35.56,0; 16 38.1,0; 17 40.64,0; 18 43.18,0; 19 45.72,0
SMT-JUMPER_2_NO_SILK = smd 0.635 x 1.27: 1 -0.406,0; 2 0.406,0
SMT-JUMPER_2_NC_TRACE_SILK = smd 0.635 x 1.27: 1 -0.508,0; 2 0.508,0
ARDUINO-TRANSISTORS_SOT363 = smd 0.5 x 0.6: 1 -0.75,-0.9; 3 0.75,-0.9; 4 0.75,0.9; 6 -0.75,0.9 | smd 0.4 x 0.6: 2 0,-0.9; 5 0,0.9
RESC1005X40 = smd 0.535 x 0.644: 1 -0.507,0; 2 0.507,0
RESPACK_4X0402 = smd 0.87 x 0.41: 1 -0.58,0.825; 4 -0.58,-0.825; 5 0.58,-0.825; 8 0.58,0.825 | smd 0.87 x 0.26: 2 -0.58,0.25; 3 -0.58,-0.25; 6 0.58,-0.25; 7 0.58,0.25
SW2-2.6-3.9X2.9X1.5+0.4MM = smd 1 x 2: 1 -2.4,0; 2 2.4,0
SOT95P280X110-6N = smd 1.119 x 0.584: 1 -1.246,0.95; 2 -1.246,0; 3 -1.246,-0.95; 4 1.246,-0.95; 5 1.246,0; 6 1.246,0.95
ESP-32S = smd 1.5 x 1: 1 -9.25,7; 2 -9.25,5.73; 3 -9.25,4.46; 4 -9.25,3.19; 5 -9.25,1.92; 6 -9.25,0.65; 7 -9.25,-0.62; 8 -9.25,-1.89; 9 -9.25,-3.16; 10 -9.25,-4.43; 11 -9.25,-5.7; 12 -9.25,-6.97; 13 -9.25,-8.24; 14 -9.25,-9.51; 25 9.25,-9.51; 26 9.25,-8.24; 27 9.25,-6.97; 28 9.25,-5.7; 29 9.25,-4.43; 30 9.25,-3.16; 31 9.25,-1.89; 32 9.25,-0.62; 33 9.25,0.65; 34 9.25,1.92; 35 9.25,3.19; 36 9.25,4.46; 37 9.25,5.73; 38 9.25,7 | smd 1 x 1.5: 15 -5.7,-11.25; 16 -4.43,-11.25; 17 -3.16,-11.25; 18 -1.89,-11.25; 19 -0.62,-11.25; 20 0.65,-11.25; 21 1.92,-11.25; 22 3.19,-11.25; 23 4.46,-11.25; 24 5.73,-11.25 | smd 4.5 x 4.5: GND 0.68,-0.33
SOT230P696X180-4N = smd 1.6 x 0.838: 1 -3.2,2.311; 2 -3.2,0; 3 -3.2,-2.311 | smd 1.6 x 3.099: 4 3.2,0
SOIC127P1030X265-20N = smd 1.9 x 0.6: 1 -4.605,5.715; 2 -4.605,4.445; 3 -4.605,3.175; 4 -4.605,1.905; 5 -4.605,0.635; 6 -4.605,-0.635; 7 -4.605,-1.905; 8 -4.605,-3.175; 9 -4.605,-4.445; 10 -4.605,-5.715; 11 4.605,-5.715; 12 4.605,-4.445; 13 4.605,-3.175; 14 4.605,-1.905; 15 4.605,-0.635; 16 4.605,0.635; 17 4.605,1.905; 18 4.605,3.175; 19 4.605,4.445; 20 4.605,5.715
TQFP48 = smd 1.016 x 0.305: 1 -4.191,2.794; 2 -4.191,2.286; 3 -4.191,1.778; 4 -4.191,1.27; 5 -4.191,0.762; 6 -4.191,0.254; 7 -4.191,-0.254; 8 -4.191,-0.762; 9 -4.191,-1.27; 10 -4.191,-1.778; 11 -4.191,-2.286; 12 -4.191,-2.794; 25 4.191,-2.794; 26 4.191,-2.286; 27 4.191,-1.778; 28 4.191,-1.27; 29 4.191,-0.762; 30 4.191,-0.254; 31 4.191,0.254; 32 4.191,0.762; 33 4.191,1.27; 34 4.191,1.778; 35 4.191,2.286; 36 4.191,2.794 | smd 0.305 x 1.016: 13 -2.794,-4.191; 14 -2.286,-4.191; 15 -1.778,-4.191; 16 -1.27,-4.191; 17 -0.762,-4.191; 18 -0.254,-4.191; 19 0.254,-4.191; 20 0.762,-4.191; 21 1.27,-4.191; 22 1.778,-4.191; 23 2.286,-4.191; 24 2.794,-4.191; 37 2.794,4.191; 38 2.286,4.191; 39 1.778,4.191; 40 1.27,4.191; 41 0.762,4.191; 42 0.254,4.191; 43 -0.254,4.191; 44 -0.762,4.191; 45 -1.27,4.191; 46 -1.778,4.191; 47 -2.286,4.191; 48 -2.794,4.191
TSSOP16 = smd 0.305 x 0.991: 1 -2.275,-2.918; 2 -1.625,-2.918; 3 -0.975,-2.918; 4 -0.325,-2.918; 5 0.325,-2.918; 6 0.975,-2.918; 7 1.625,-2.918; 8 2.275,-2.918; 9 2.275,2.918; 10 1.625,2.918; 11 0.975,2.918; 12 0.325,2.918; 13 -0.325,2.918; 14 -0.975,2.918; 15 -1.625,2.918; 16 -2.275,2.918

### Placement (x,y rotation side)
B1  41.27,11.43 0 top
C1  14.45,13.97 90 top
C2  34.61,6.03 90 top
C3  24.13,4.45 90 top
C4  60.64,24.13 0 top
C5  39.05,20.64 180 top
C6  40.96,4.76 0 top
C7  27.94,13.34 0 top
C8  18.26,6.67 0 top
C9  20.32,19.37 90 top
C10  21.59,19.37 90 top
C11  27.94,12.06 0 top
C12  27.94,10.79 0 top
D1  36.51,12.06 270 top
D2  30.48,12.06 90 top
F1  13.97,4.45 0 top
IC1  37.78,6.19 90 top
J4  46.04,1.27 0 top
J5  2.54,5.4 270 top
J6  10.48,1.27 0 top
J9  56.2,24.13 180 top
JP1  30.8,12.7 270 bottom
JP2  14.61,14.61 270 bottom
JP3  57.78,21.91 180 bottom
JP4  28.57,12.7 270 bottom
Q1  39.05,17.46 90 top
Q2  7.22,23.81 270 top
Q3  15.24,19.68 180 top
R1  10.16,9.21 90 top
R2  10.16,4.45 270 top
R3  2.54,23.81 0 top
R4  35.56,17.46 0 top
R5  18.1,19.68 0 top
R6  4.52,23.81 90 top
R7  32.07,12.06 270 top
R8  38.1,3.81 180 top
R9  58.42,24.13 0 top
R10  40.32,14.13 270 top
R11  40.32,12.22 270 top
R12  40.32,10.32 270 top
R13  22.86,19.37 90 top
SW1  19.68,4.45 180 top
TVS1  12.7,7.94 90 top
U1  53.98,12.7 270 top
U3  29.53,6.03 0 top
U4  6.99,16.51 270 top
U5  20.95,12.7 0 top
U6  29.53,18.73 180 top

### Tracks (layer width: path | path; a pad name or v marks a point on that pad's centre or on a via)
3.3V  (via drill 0.35)  (1 unrouted)
  Top 0.254: R3.6 R3.7 | R4.1 R4.2 | R3.8 3.41,24.92 5.32,24.92 5.48,24.77 5.48,24.2 5.87,23.81 Q2.2
  Top 0.305: Q2.2 Q2.5 8.56,23.81 8.61,23.77 9.05,23.77 9.65,23.16 9.65,22.58 9.52,22.45 9.52,19.36 v7.3,17.14 | R3.7 R3.8 | Q3.5 15.24,18.53 14.8,18.1 14.29,18.1 13.8,17.61 13.8,14.04 14.35,13.48 C1.1 | v33.86,17.98 34.16,18.29 R4.1 | U1.2 59.7,23.68 C4.1 R9.2 | Q1.5 39.05,17.46 | 39.05,17.46 Q1.2 | 39.05,19.56 39.05,19.05 | 39.05,17.46 39.05,19.05 | 39.05,19.05 39.56,19.56 39.69,19.56 | 39.05,19.05 38.54,19.56 38.42,19.56 | R8.2 36.48,4.92 IC1.5 | Q3.2 15.24,21.34 15.88,21.97 18.34,21.97 18.73,21.59 18.73,20.56 R5.8 R5.7
  Top 0.406: Q3.5 Q3.2 | v8.89,13.65 U4.17 | U6.1 33.86,19.6 | v33.86,17.98 33.86,19.6 | 33.86,19.6 34.38,19.6 34.45,19.53
  Top 0.508: IC1.5 34.62,5.24
  Top 0.61: U4.17 8.89,12.52 9.7,13.34 14.3,13.34 C1.1 14.45,11.06 v14.24,10.86 | U3.4 32.73,8.28 33.78,9.33 v33.78,15.98 v33.77,15.99 | U1.2 59.7,20.65 54.61,15.56 45.4,15.56 43.96,17 43.96,19.1 43.5,19.56 | 40.96,20.64 C5.1 42.42,20.64 42.96,20.1 | 42.55,19.56 39.69,19.56 39.05,19.56 38.42,19.56 36.63,19.56 36.3,19.89 34.81,19.89 34.45,19.53 33.86,18.93 v33.86,17.98 | 42.55,19.56 43.5,19.56 | 42.96,20.1 43.5,19.56 | 42.55,19.56 42.96,19.98 42.96,20.1 | 34.62,5.24 C2.1 | v24.77,6.99 25.72,6.03 U3.2
  Top 0.813: C2.1 32.84,5.26 32.7,5.4 | U3.2 27.28,6.99 31.77,6.99 U3.4
  Bottom 0.406: v7.3,17.14 7.3,15.24 v8.89,13.65
  Bottom 0.61: v33.77,15.99 33.77,17.9 v33.86,17.98 | v14.24,10.86 14.29,10.81 14.29,5.08 J6.4 18.73,1.91 18.73,4.99 21.22,7.48 24.18,7.48 24.68,6.99 v24.77,6.99
5V  (via drill 0.35)  (2 unrouted)
  Top 0.254: R5.5 R5.6 | R4.4 R4.3
  Top 0.305: C8.1 18.67,7.57 U5.14 18.67,11.05 19.04,11.42 21.59,11.42 | 21.23,16.87 U5.42 | 22.23,11.42 24.7,11.42 24.7,11.43 U5.28 25.99,11.43 25.99,11.42 26.39,11.42 26.68,11.71 26.68,13.34 C7.1 | 22.23,11.42 21.91,11.42 | 21.91,11.42 21.59,11.42 | v18.73,18.1 18.73,18.8 R5.5 20.3,18.86 C9.1 C10.1 21.21,18.5 U5.42 | R3.5 3.23,23.1 3.69,23.1 3.89,23.3 R6.1 4.52,22.52 v4.47,22.46 | U5.42 21.21,15.62 21.91,14.92 21.91,11.75 | 21.91,11.42 21.91,11.75 | 21.59,11.42 21.59,11.43 21.91,11.75 | 21.91,11.75 22.23,11.43 22.23,11.42
  Top 0.406: R4.4 34.16,16.64 32.07,18.73 24.13,18.73 22.99,19.88 | R13.2 22.49,19.51 22.38,19.51 21.75,18.88 C10.1
  Top 0.61: 15.24,4.58 F1.2 | 16.83,6.67 17.45,6.67 18.73,5.39 18.73,4.13 19.05,3.81 20.32,3.81 21.17,2.96 23.42,2.96 C3.1
  Top 0.813: C8.1 16.83,6.67 15.88,6.67 15.24,6.03 15.24,4.58 | v26.35,4.76 26.35,3.75 | v52.39,7.3 v54.29,7.3 | U3.3 24.18,3.72 C3.1
  Bottom 0.305: v4.47,22.46 4.47,20.31 4.76,20.01 15.55,20.01 15.91,20.37 16.48,20.37 16.88,19.97 16.88,19.02 17.79,18.1 v18.73,18.1
  Bottom 0.813: v26.35,4.76 46.35,4.76 48.9,7.3 v52.39,7.3 | J4.6 60.01,2.54 60.01,5.77 58.48,7.3 v54.29,7.3
BLU
  Top 0.305: R12.2 39.91,10.23 39.86,10.23 39.67,10.42 39.67,11.4 38.42,12.65 37.51,12.65 37.03,13.13 36.14,13.13 D1.6
CC1
  Top 0.254: J5.A5 7.68,6.69 8.49,6.69 8.78,6.99 9.84,6.99 10.16,7.3 R1.1
CC2
  Top 0.254: R2.2 9.87,3.65 9.68,3.65 9.48,3.45 8.94,3.45 8.74,3.65 J5.B5
D_N  (via drill 0.35)
  Top 0.254: U4.14 5.08,10.48 4.81,10.2 4.81,6.63 6.22,5.22 6.33,5.22 6.4,5.15 J5.A7 8.89,5.15 v9.05,4.99 | TVS1.4 13.65,8.57 12.64,7.56 11.33,7.56 11.15,7.38 11.15,6.71 10.86,6.41 9.89,6.41 9.63,6.15 8.89,6.15 | 8.89,6.15 J5.B7 | 8.89,6.15 v9.05,6.3
  Bottom 0.254: v9.05,6.3 v9.05,4.99
D_P  (via drill 0.35)
  Top 0.254: U4.15 6.35,11.11 6.33,11.11 5.24,10.03 5.24,6.81 6.4,5.65 J5.A6 10.16,5.65 | TVS1.1 10.71,5.65 10.16,5.65 | 10.16,5.65 v10.16,5.75 | J5.B6 8.46,4.65 8.78,4.33 8.98,4.33 v9.21,4.11
  Bottom 0.254: v9.21,4.11 10.16,5.06 v10.16,5.75
ESP_ACK  (via drill 0.35)
  Top 0.254: R4.8 36.22,18.21 36.33,18.21 36.88,18.75 37.42,18.75 37.96,18.21 Q1.4 | v48.26,16.51 50.81,19.07 U1.9
  Top 0.305: R4.8 36.14,18.87 v35.96,19.05
  Bottom 0.254: 41.59,9.84 v48.26,16.51
  Bottom 0.305: 41.59,9.84 41.26,9.84 40.59,10.51 40.59,14.89 40.99,15.29 41.01,15.29 41.96,16.25 41.96,17.98 40.89,19.05 v35.96,19.05
ESP_BLUE  (via drill 0.35)
  Top 0.254: R10.1 41.24,14.64 v41.27,14.61 | v45.09,18.41 47.01,20.34 U1.12
  Top 0.305: 46.99,21.93 U1.12
  Bottom 0.305: v41.27,14.61 v45.09,18.41
ESP_CS  (1 unrouted)
  Top 0.254: IC1.1 39.93,5.24 40.07,5.38 48.28,5.38 49.55,4.11 U1.29
ESP_EN  (via drill 0.35)  (2 unrouted)
  Top 0.254: C6.2 41.44,1.75 J6.13
  Top 0.305: R9.1 57.91,23.68 58.42,23.18 58.42,21.96 U1.3 58.44,20.56 v58.39,20.52
  Bottom 0.305: v58.39,20.52 58.39,22.27 58.29,22.36
ESP_GREEN  (via drill 0.35)
  Top 0.254: R11.1 41.24,12.73 v41.27,12.7 | 49.55,20.64 49.55,18.75 46.99,16.19 46.31,16.19 v45.35,17.14
  Top 0.305: U1.10 49.55,20.64
  Bottom 0.305: v45.35,17.14 44.72,16.51 44.72,16.14 v41.27,12.7
ESP_IO0  (via drill 0.35)
  Top 0.254: v39.69,3.76 38.66,3.76 R8.1 | v43.18,3.81 44.1,3.81
  Top 0.305: 44.1,3.81 U1.25 43.5,2.48 J6.14 | Q2.4 8.77,23.06 v8.97,22.86
  Bottom 0.254: v8.97,22.86 8.97,21.89 9.53,21.33 15,21.33 15.36,21.69 17.27,21.69 17.51,21.93 18.05,21.93 18.44,21.55 18.44,21 17.77,20.33 17.77,19.38 17.96,19.19 19.18,19.19 19.82,18.55 19.82,16.96 19.08,16.23 19.08,15.58 18.2,14.7 18.2,12.58 18.6,12.18 18.6,11.63 18.1,11.13 15.29,11.13 14.9,10.75 14.9,7.63 15.66,6.87 16.69,6.87 17.96,8.14 25.08,8.14 25.64,7.58 25.64,4.47 26.35,3.76 v39.69,3.76 | 39.69,3.81 v39.69,3.76 | v39.69,3.76 39.74,3.81 v43.18,3.81
ESP_MISO
  Top 0.305: IC1.2 40.16,6.19 40.52,5.84 43.62,5.84 44.77,6.99 44.77,8.26 45.72,9.21 59.05,9.21 59.7,8.56 U1.37
ESP_MOSI  (via drill 0.35)
  Top 0.254: U1.13 45.27,21.48 45.27,21.07 44.73,20.53 43.39,20.53 42.38,21.54 34.55,21.54 v33.97,20.95 | v28.57,20.32 28.55,20.34 U6.6
  Bottom 0.254: v33.97,20.95 33.34,20.32 v28.57,20.32
ESP_RED  (via drill 0.35)
  Top 0.254: R12.1 41.24,10.83 v41.27,10.79 | U1.11 48.27,18.43 v46.67,16.83
  Top 0.305: 48.26,21.93 U1.11
  Bottom 0.305: v41.27,10.79 46.67,16.19 v46.67,16.83
ESP_RX  (via drill 0.35)
  Top 0.254: U6.15 31.15,16.39 31.43,16.67 32.38,16.67 32.94,16.11 v32.94,12.25 | v52.97,6.35 53.22,6.59 54.59,6.59 55.62,7.62 56.4,7.62 56.72,7.3 56.72,5.28 55.88,4.45 55.88,3.46 U1.34
  Bottom 0.254: v32.94,12.25 32.94,7.67 33.48,7.13 47.72,7.13 48.6,8.01 52.68,8.01 53.1,7.6 53.1,7.01 52.97,6.88 v52.97,6.35
ESP_RX_5V  (via drill 0.35)
  Top 0.305: v29.84,14.79 30.05,14.99 30.14,14.99 30.5,15.35 U6.14
  Bottom 0.305: v29.84,14.79 29.84,13.57 29.83,13.56 29.83,12.65 30.03,12.46 30.63,12.46 JP1.2 30.96,12.46 32.19,12.46 35.12,15.39 39.16,15.39 39.63,14.92 39.63,10.11 40.86,8.88 44.72,8.88 45.76,7.84 46.58,7.84 47.62,8.89 52.7,8.89 53.56,8.04 53.56,7 53.66,6.9 J4.4
ESP_SCK  (via drill 0.35)
  Top 0.305: U1.30 50.38,3.89 50.38,4.34 50.18,4.53 50.03,4.53 v46.04,8.52 | v31.43,14.29 30.31,14.29 30.13,14.11 29.56,14.11 29.16,14.51 29.16,15.07 29.2,15.11 U6.12
  Bottom 0.305: v46.04,8.52 45.2,9.36 41.06,9.36 40.11,10.31 40.11,15.14 39.37,15.88 34.92,15.88 33.34,14.29 v31.43,14.29
ESP_SCL  (via drill 0.35)
  Top 0.254: U1.36 58.44,6.02 v58.1,6.35 | v55.56,6.03 53.59,6.03 53.25,5.69 50.78,5.69 v50.31,5.22
  Bottom 0.254: v58.1,6.35 55.88,6.35 v55.56,6.03 | v50.31,5.22 47.6,2.52 40.44,2.52 39.2,1.27 J6.12
ESP_SDA  (via drill 0.35)
  Top 0.254: U1.33 54.16,3.92 54.16,4.33 53.45,5.04 v51.44,5.04
  Bottom 0.254: v51.44,5.04 51.42,5.04 50.58,5.88 48.48,5.88 45.7,3.1 37.71,3.1 J6.11
ESP_TX  (via drill 0.35)
  Top 0.254: R4.7 36.76,17.71 v37.15,18.1 | v40.8,16.75 39.99,16.75 Q1.1 | U1.35 57.15,3.46 v57.15,8.52 | v57.15,10.16 56.2,11.11 56.2,14.4 55.87,14.72 v49.21,14.72
  Bottom 0.254: v40.8,16.75 40.08,16.75 38.73,18.1 v37.15,18.1 36.85,18.39 35.68,18.39 35.3,18.78 35.3,19.32 35.68,19.71 45.99,19.71 48.92,16.78 48.92,15.02 v49.21,14.72 | v57.15,8.52 v57.15,10.16
ESP_TX_5V  (2 unrouted)
  Top 0.254: Q1.6 38.08,16.64 37.89,16.64 37.42,16.17 36.88,16.17 36.41,16.64 R4.5
GND  (18 unrouted)
  pour Top (isolate 0.254): 0,25.4 62.23,25.4 62.23,0 0,0
  pour Bottom (isolate 0.254): 0,25.4 62.23,25.4 62.23,0 0,0
GRN
  Top 0.305: R10.2 39.06,13.62 D1.4
IO0_5V  (via drill 0.35)
  Top 0.305: Q2.3 5.66,23.06 v5.43,22.83 5.43,23.46 4.98,23.9 4.94,23.9 R6.2
  Bottom 0.254: v5.43,22.83 5.43,21.23 6.19,20.47 15.36,20.47 15.72,20.82 16.66,20.82 17.33,20.16 17.33,19.2 17.98,18.55 18.24,18.55 18.44,18.75 19,18.75 19.39,18.37 19.39,17.82 19,17.44 18.46,17.44 18.26,17.64 17.96,17.64 17.77,17.45 17.77,14.57 17.59,14.39 14.8,14.39 JP2.2
N$2
  Top 0.305: D2.C 31.7,12.94 R7.1
N$4  (1 unrouted)
PA0_D2  (1 unrouted)
PA1_D7  (1 unrouted)
PA2_D20_SDA  (via drill 0.35)
  Top 0.254: v20.64,20.95 20.61,20.95 18.71,22.86 16.83,22.86 J9.17 | 19.2,16.92 19.19,16.9 19.19,14.57 19.51,14.24 19.51,13.51 v19.58,13.44
  Top 0.305: U5.46 19.2,16.92 19.2,17.14
  Bottom 0.254: v20.64,20.95 20.64,20.88 23,18.52 23,17.62 22.36,16.98 21.06,16.98 19.95,15.87 19.95,15.22 19.58,14.85 v19.58,13.44
PA3_D21_SCL  (via drill 0.35)
  Top 0.254: v18.86,13.97 18.43,14.4 v18.43,15.85 | v19.68,20.95 19.68,21.27 18.53,22.43 14.72,22.43 J9.18
  Top 0.305: U5.47 18.67,16.1 v18.43,15.85
  Bottom 0.254: v19.68,20.95 19.68,19.91 20.86,18.73 22.18,18.73 22.57,18.34 22.57,17.8 22.18,17.41 20.52,17.41 20.25,17.14 20.25,16.79 19.51,16.05 19.51,15.4 18.86,14.74 v18.86,13.97 18.86,14.09
PA4_D24_TX2  (1 unrouted)
PA5_D23_RX2  (1 unrouted)
PA6_D28  (1 unrouted)
PA7_D29  (1 unrouted)
PB0_D9~  (1 unrouted)
PB1_D10~  (1 unrouted)
PB2_D5~  (1 unrouted)
PB4_D27_TX0  (via drill 0.35)
  Top 0.254: Q3.3 14.49,19.59 14.29,19.39 13.93,19.39 | 13.93,19.39 13.38,19.39 9.12,15.13 v8.67,15.13 | 13.93,19.39 | v17.94,11.91 16.8,11.91 U5.8
  Top 0.305: R3.4 2.55,22.39 2.93,22.39 3.18,22.15 3.18,19.63 v4.76,18.05
  Bottom 0.254: v8.67,15.13 10.43,15.13 13.65,11.91 v17.94,11.91
  Bottom 0.305: v8.67,15.13 7.99,15.81 7.99,17.43 7.36,18.05 v4.76,18.05
PB5_D26_RX0
  Top 0.254: U5.9 16.72,11.47 16.14,11.47 15.07,12.54 15.07,16.34 15.99,17.26 Q3.6
  Top 0.305: Q3.6 16.02,18.75 16.02,17.93 16.43,17.53 16.99,17.53 17.39,17.93 17.39,18.73 R5.4
PC0_MOSI  (1 unrouted)
PC1_MISO  (via drill 0.35)
  Top 0.305: IC1.4 36.48,6.22 v36.51,6.19 | v15.56,10.48 16.08,10.48 16.12,10.44 16.74,10.44 U5.11
  Bottom 0.254: v15.56,10.48 15.56,7.62 15.88,7.3 16.51,7.3 18.1,8.89 31.11,8.89 33.97,6.03 36.35,6.03 v36.51,6.19
PC2_SCK  (via drill 0.35)
  Top 0.254: U6.11 28.55,14.68 v28.48,14.61 | U5.12 17.88,9.91 v17.94,9.84
  Bottom 0.254: v28.48,14.61 23.72,9.84 v17.94,9.84
PC4_D1_TX1  (1 unrouted)
PC5_D0_RX1  (1 unrouted)
PC6_D4  (1 unrouted)
PD0_A0  (via drill 0.35)
  Top 0.254: U5.20 21.67,8.46 21.67,7.88 19.57,5.78 v19.57,4.64
  Bottom 0.254: v19.57,4.64 19.57,2.34 J6.5
PD1_A1  (via drill 0.35)
  Top 0.254: U5.21 22.23,7.82 20.38,5.97 20.38,4.72 v20.45,4.64
  Bottom 0.254: v20.45,4.64 20.45,4 J6.6
PD2_A2  (via drill 0.35)
  Top 0.254: U5.22 22.73,7.4 v21.8,6.46
  Bottom 0.254: v21.8,6.46 21.8,5.19 J6.7
PD3_A3  (via drill 0.35)
  Top 0.254: U5.23 23.24,6.98 v22.74,6.47
  Bottom 0.254: v22.74,6.47 24.78,4.43 24.78,4.11 27.62,1.27 J6.8
PD4_A4  (via drill 0.35)
  Top 0.254: U5.24 23.75,6.73 v23.84,6.64
  Bottom 0.254: v23.84,6.64 25.21,5.27 25.21,4.29 26.98,2.52 28.77,2.52 30.02,1.27 J6.9
PD5_A5  (via drill 0.35)
  Top 0.254: J6.10 28.57,6.03 v28.26,6.03 | U5.25 26.64,9.91 26.85,9.69 27.77,9.69 28.26,9.21 v28.26,7.94
  Bottom 0.254: v28.26,6.03 v28.26,7.94
PD6_A6
  Top 0.305: U5.26 26.77,10.41 27.04,10.15 29.44,10.15 D2.A
PD7_A7_AREF  (1 unrouted)
  Top 0.305: U5.27 27.33,10.92 C12.1 C11.1
PE0_D11  (1 unrouted)
PE1_D12  (1 unrouted)
PE2_D13  (1 unrouted)
PE3_D8  (1 unrouted)
PF2_D35_A12  (1 unrouted)
PF3_D36_A13  (via drill 0.35)  (1 unrouted)
  Top 0.254: R4.6 36.76,17.21 v37.15,16.83 | v40.8,18.18 39.99,18.18 Q1.3
  Bottom 0.305: v37.15,16.83 39.36,16.83 40.12,16.07 41.08,16.07 41.48,16.46 41.48,17.49 v40.8,18.18
PF4_D6~  (1 unrouted)
PF5_D3~  (1 unrouted)
PF6_RST  (2 unrouted)
  Top 0.305: J6.3 15.56,2.86 15.88,3.17 16.51,3.17 17.29,3.95 SW1.2
RED
  Top 0.305: R11.2 40.04,11.72 38.62,13.13 37.84,13.13 D1.5
RESETN
  Top 0.305: U4.11 0.64,12.54 0.64,18.41 | 0.64,18.41 0.64,18.73 | 0.95,18.73 3.11,18.73 5.38,16.46 7.58,16.46 7.99,16.86 7.99,17.14 10.79,19.95 10.79,23.82 J9.19 | 0.64,18.73 0.95,18.73 | 0.64,18.73 0.64,18.74 0.64,19.05 | R3.2 1.32,24.06 0.64,23.38 0.64,19.05 | 0.95,18.73 0.64,18.41 | 0.95,18.73 0.64,19.05
RX_D11  (via drill 0.35)
  Top 0.254: U4.10 1.27,22.61 1.22,22.66 1.22,23.32 1.33,23.43 1.4,23.5 1.46,23.56 R3.3
  Top 0.305: v13.65,18.73 13.71,18.79 Q3.4 | v1.32,19.53 1.32,21.07 U4.10
  Bottom 0.305: v1.32,19.53 1.27,19.53 2.06,18.73 v13.65,18.73
SWCLK  (via drill 0.35)
  Top 0.305: v2.54,13.97 U4.12 | v0.81,24.59 1.91,24.59 R3.1
  Bottom 0.305: v0.81,24.59 0.64,24.42 0.64,15.88 v2.54,13.97 3.16,13.97 3.53,14.34 4.92,14.34 8.58,10.67 8.58,9.16 8.37,8.95 8.37,3.98 8.93,3.42 10.86,3.42 J6.2
SWDIO  (via drill 0.35)
  Top 0.305: v3.81,13.65 U4.13
  Bottom 0.305: J6.1 8.81,2.94 8.72,2.94 7.88,3.78 7.88,9.15 8.1,9.36 8.1,10.07 8.1,10.08 8.1,10.48 4.92,13.65 v3.81,13.65
TX_D11  (via drill 0.35)
  Top 0.305: U4.9 2.54,19.68 v2.38,19.53 | R5.2 16.44,19.93 v16.19,19.68 16.19,20.38 Q3.1
  Bottom 0.305: v16.19,19.68 16.03,19.53 v2.38,19.53
UPDI_3V3  (via drill 0.35)
  Top 0.305: U4.7 U4.6 6.35,21.98 v7.23,22.86 | v7.22,24.5 6.39,24.5 Q2.1 | R5.1 17.52,21.01 v17.78,21.27
  Bottom 0.254: v7.23,22.86 7.23,21.29 7.62,20.9 15.18,20.9 15.54,21.26 17.77,21.26 v17.78,21.27
  Bottom 0.305: v7.23,22.86 7.23,24.5 v7.22,24.5
UPDI_5V  (via drill 0.35)  (1 unrouted)
  Top 0.254: v21.91,18.07 21.91,17.66 21.77,17.52 21.77,16.94 U5.41
  Top 0.305: Q2.6 8.85,24.56 v8.97,24.45 | R5.3 17.48,19.39 16.95,19.39 16.75,19.2 16.75,18.26 v16.71,18.22
  Bottom 0.254: v8.97,24.45 8.97,23.79 9.63,23.13 9.63,22.29 10.16,21.76 14.82,21.76 15.18,22.12 17.09,22.12 17.33,22.36 18.23,22.36 18.87,21.73 18.87,20.11 20.91,18.07 v21.91,18.07 | v16.71,18.22 16.71,16.97 v16.83,16.85
V_USB  (via drill 0.35)
  Top 0.406: J5.A4B9 6.89,7.85 v6.35,7.3 | J5.B4A9 6.89,2.95 v6.35,3.49 | F1.1 13.88,5.75 14.1,5.75 14.32,5.97 14.32,9.9 14.1,10.12 13.2,10.12 12.7,9.62 TVS1.5
  Top 0.61: J5.B4A9 8.57,2.95 8.68,2.84 10.96,2.84 F1.1
  Bottom 0.406: v6.35,7.3 v6.35,3.49